# Altium schematic sheet Controller.SchDoc
size A4
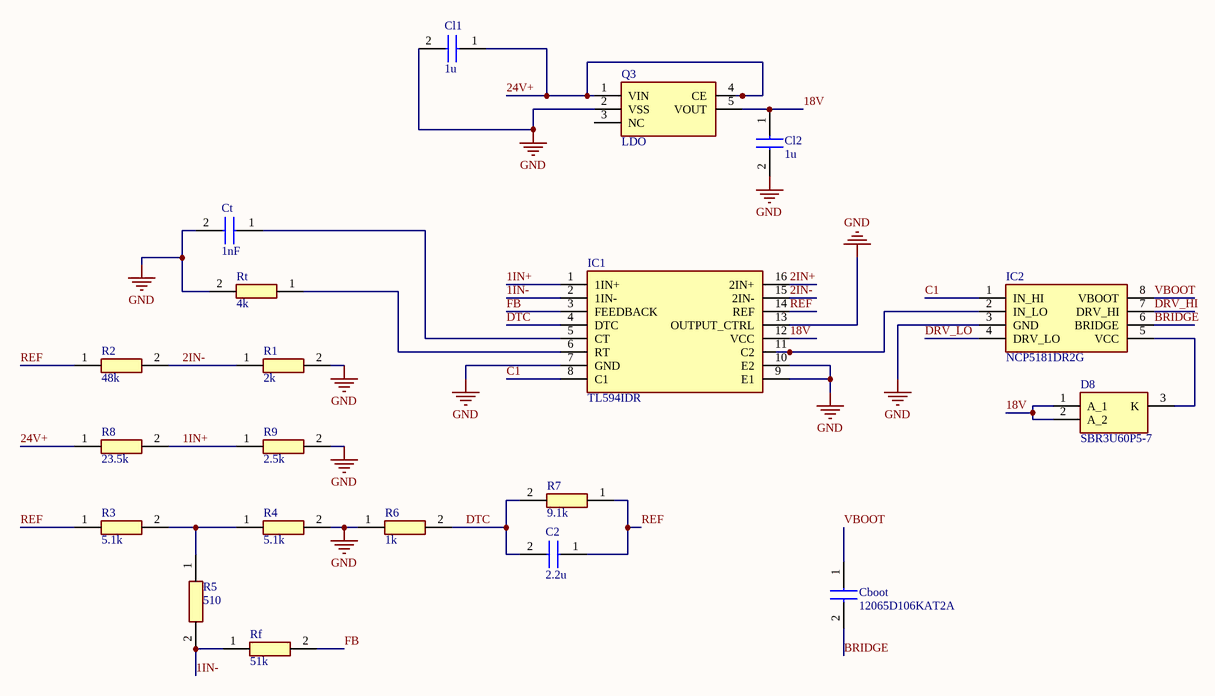
[diagram p0: Controller.SchDoc]

## Parts
C2  2.2u  [CAPC1005X55N]
Cboot  12065D106KAT2A  [CAPC3216X229N]
Cl1  1u  [CAPC3225X105N]
Cl2  1u  [CAPC3225X105N]
Ct  1nF  [CAPC1608X90N]
D8  SBR3U60P5-7  [SBR3U60P57]
IC1  TL594IDR  [SOIC127P600X175-16N]
IC2  NCP5181DR2G  [SOIC127P600X175-8N]
Q3  LDO  [SOT95P280X120-5N]
R1  2k  [RESC1608X55N]
R2  48k  [RESC2012X65N]
R3  5.1k  [RESC1005X40N]
R4  5.1k  [RESC1005X40N]
R5  510  [RESC1608X50N]
R6  1k  [RESC1608X55N]
R7  9.1k  [RESC1005X40N]
R8  23.5k  [RESC1608X55N]
R9  2.5k  [RESC2012X60N]
Rf  51k  [RESC1005X40N]
Rt  4k  [RESC1608X55N]

## Nets
GND: Cl1.2 Cl2.2 Ct.2 IC1.7(GND) IC1.9(E1) IC1.10(E2) IC1.13(OUTPUT_CTRL) IC2.3(GND) Q3.2(VSS) R1.2 R4.2 R6.1 R9.2 Rt.2
1IN+: IC1.1(1IN+) R8.2 R9.1
1IN-: IC1.2(1IN-) R5.2 Rf.1
2IN+: IC1.16(2IN+)
2IN-: IC1.15(2IN-) R1.1 R2.2
18V: Cl2.1 D8.1(A_1) D8.2(A_2) IC1.12(VCC) Q3.5(VOUT)
24V+: Cl1.1 Q3.1(VIN) Q3.4(CE) R8.1
BRIDGE: Cboot.2 IC2.6(BRIDGE)
C1: IC1.8(C1) IC2.1(IN_HI)
DRV_HI: IC2.7(DRV_HI)
DRV_LO: IC2.4(DRV_LO)
DTC: C2.2 IC1.4(DTC) R6.2 R7.2
FB: IC1.3(FEEDBACK) Rf.2
REF: C2.1 IC1.14(REF) R2.1 R3.1 R7.1
VBOOT: Cboot.1 IC2.8(VBOOT)
NetCt_1: Ct.1 IC1.5(CT)
NetD8_3: D8.3(K) IC2.5(VCC)
NetIC1_6: IC1.6(RT) Rt.1
NetIC1_11: IC1.11(C2) IC2.2(IN_LO)
NetR3_2: R3.2 R4.1 R5.1

Not connected (* = marked no-connect by the designer): Q3 3(NC)

## Library data of the parts
C2 = C0402C225K9PACTU: Capacitor; Manufacturer_Name: Kemet; Datasheet Link: https://content.kemet.com/datasheets/KEM_C1002_X7R_SMD.pdf; Height: 0.55mm; Manufacturer_Part_Number: C0402C225K9PACTU; Mouser Part Number: 80-C0402C225K9P; Mouser Price/Stock: https://www.mouser.co.uk/ProductDetail/KEMET/C0402C225K9PACTU/?qs=7hO1d5R1VgvbvfUaNq9%252BYQ%3D%3D; Arrow Part Number: C0402C225K9PACTU; Arrow Price/Stock: https://www.arrow.com/en/products/c0402c225k9pactu/kemet-corporation
Cboot = 12065D106KAT2A: Capacitor; Manufacturer_Name: AVX; Datasheet Link: http://datasheets.avx.com/cx5r.pdf; Height: 2.29mm; Manufacturer_Part_Number: 12065D106KAT2A; Mouser Part Number: 581-12065D106KAT2A; Mouser Price/Stock: https://www.mouser.co.uk/ProductDetail/AVX/12065D106KAT2A?qs=KdTYp8tcPglFZs244%2FIMaw%3D%3D; Arrow Part Number: 12065D106KAT2A; Arrow Price/Stock: https://www.arrow.com/en/products/12065d106kat2a/avx
Cl1 Cl2 = 885012209047: Capacitor; Manufacturer_Name: Wurth Elektronik; Datasheet Link: https://katalog.we-online.com/pbs/datasheet/885012209047.pdf; Height: 1.05mm; Manufacturer_Part_Number: 885012209047; Mouser Part Number: 710-885012209047; Mouser Price/Stock: https://www.mouser.co.uk/ProductDetail/Wurth-Elektronik/885012209047/?qs=0KOYDY2FL29YEbVS2nM5KQ%3D%3D
Ct = 06031C102KAZ2A: Capacitor; Manufacturer_Name: AVX; Datasheet Link: https://componentsearchengine.com/Datasheets/1/06031A100FAT2A.pdf; Height: 0.9mm; Manufacturer_Part_Number: 06031C102KAZ2A; Mouser Part Number: 581-06031C102KAZ2A; Mouser Price/Stock: https://www.mouser.co.uk/ProductDetail/AVX/06031C102KAZ2A?qs=ahudlVbFbatc7%2FoXGMS0PQ%3D%3D
D8 = SBR3U60P5-7: Schottky Diode; Manufacturer_Name: Diodes Inc.; Datasheet Link: https://www.mouser.com/datasheet/2/115/SBR3U60P5-941054.pdf; Height: 1.1mm; Manufacturer_Part_Number: SBR3U60P5-7; Mouser Part Number: 621-SBR3U60P5-7; Mouser Price/Stock: https://www.mouser.co.uk/ProductDetail/Diodes-Incorporated/SBR3U60P5-7/?qs=nJRy1mI8RR%252BxxKqfP%2FhEGg%3D%3D; Arrow Part Number: SBR3U60P5-7; Arrow Price/Stock: https://www.arrow.com/en/products/sbr3u60p5-7/diodes-incorporated
IC1 = TL594IDR: Integrated Circuit; Manufacturer_Name: Texas Instruments; Datasheet Link: http://www.ti.com/lit/gpn/TL594; Height: 1.75mm; Manufacturer_Part_Number: TL594IDR; Mouser Part Number: 595-TL594IDR; Mouser Price/Stock: https://www.mouser.co.uk/ProductDetail/Texas-Instruments/TL594IDR/?qs=odmYgEirbwx2xq08uKs%2FLA%3D%3D; Arrow Part Number: TL594IDR; Arrow Price/Stock: https://www.arrow.com/en/products/tl594idr/texas-instruments
IC2 = NCP5181DR2G: Integrated Circuit; Manufacturer_Name: ON Semiconductor; Datasheet Link: http://www.onsemi.com/pub/Collateral/NCP5181-D.PDF; Height: 1.75mm; Manufacturer_Part_Number: NCP5181DR2G; Mouser Part Number: 863-NCP5181DR2G; Mouser Price/Stock: https://www.mouser.co.uk/ProductDetail/ON-Semiconductor/NCP5181DR2G/?qs=OSf9jACorvZepnMsAKlxsQ%3D%3D; Arrow Part Number: NCP5181DR2G; Arrow Price/Stock: https://www.arrow.com/en/products/ncp5181dr2g/on-semiconductor
Q3 = XC6210B302MR-G: Transistor; Manufacturer_Name: Torex; Datasheet Link: https://componentsearchengine.com/Datasheets/1/XC6210B302MR-G.pdf; Height: 1.2mm; Manufacturer_Part_Number: XC6210B302MR-G; Mouser Part Number: 865-XC6210B302MR-G; Mouser Price/Stock: https://www.mouser.co.uk/ProductDetail/Torex-Semiconductor/XC6210B302MR-G?qs=AsjdqWjXhJ%2F8LVwdgROYaw%3D%3D
R1 R6 = RCA060310R0FKEAHP: Resistor; Manufacturer_Name: Vishay; Datasheet Link: https://www.vishay.com/docs/20067/rcahp.pdf; Height: 0.55mm; Manufacturer_Part_Number: RCA060310R0FKEAHP; Arrow Part Number: RCA060310R0FKEAHP; Arrow Price/Stock: https://www.arrow.com/en/products/rca060310r0fkeahp/vishay
R2 = CPF0805B49K9E1: Resistor; Manufacturer_Name: TE Connectivity; Datasheet Link: http://docs-europe.electrocomponents.com/webdocs/13d1/0900766b813d116f.pdf; Height: 0.65mm; Manufacturer_Part_Number: CPF0805B49K9E1; Mouser Part Number: 279-CPF0805B49K9E1; Mouser Price/Stock: https://www.mouser.co.uk/ProductDetail/TE-Connectivity-Holsworthy/CPF0805B49K9E1/?qs=iJVBkmKXgrkcN8Razl5GKw%3D%3D
R3 R4 = CRCW04025K10JNED: Resistor; Manufacturer_Name: Vishay; Datasheet Link: http://www.vishay.com/docs/20035/dcrcwe3.pdf; Height: 0.4mm; Manufacturer_Part_Number: CRCW04025K10JNED; Mouser Part Number: 71-CRCW0402J-5.1K-E3; Mouser Price/Stock: https://www.mouser.co.uk/ProductDetail/Vishay-Dale/CRCW04025K10JNED/?qs=DKbL89i6OEozZLVEbDGZhw%3D%3D; Arrow Part Number: CRCW04025K10JNED; Arrow Price/Stock: https://www.arrow.com/en/products/crcw04025k10jned/vishay
R5 = CRCW0603510RJNEA: Resistor; Manufacturer_Name: Vishay; Datasheet Link: http://www.vishay.com/docs/20035/dcrcwe3.pdf; Height: 0.5mm; Manufacturer_Part_Number: CRCW0603510RJNEA; Mouser Part Number: 71-CRCW0603J-510-E3; Mouser Price/Stock: https://www.mouser.co.uk/ProductDetail/Vishay-Dale/CRCW0603510RJNEA/?qs=F8Fiu5nZiPjhir5Uy48eTQ%3D%3D; Arrow Part Number: CRCW0603510RJNEA; Arrow Price/Stock: https://www.arrow.com/en/products/crcw0603510rjnea/vishay
R7 = CRCW04029K10JNED: Resistor; Manufacturer_Name: Vishay; Datasheet Link: http://www.vishay.com/docs/20035/dcrcwe3.pdf; Height: 0.4mm; Manufacturer_Part_Number: CRCW04029K10JNED; Mouser Part Number: 71-CRCW0402J-9.1K-E3; Mouser Price/Stock: https://www.mouser.co.uk/ProductDetail/Vishay-Dale/CRCW04029K10JNED/?qs=lxmYmG9KtX%2FHs4nfN6Hr1A%3D%3D
R8 Rt = MCT06030C2352FP500: Resistor; Manufacturer_Name: Vishay; Datasheet Link: http://www.vishay.com/docs/28705/mcx0x0xpro.pdf; Height: 0.55mm; Manufacturer_Part_Number: MCT06030C2352FP500; Mouser Part Number: N/A; Mouser Price/Stock: https://www.mouser.co.uk/ProductDetail/Vishay-Beyschlag/MCT06030C2352FP500/?qs=iuLH8FrUFAt7r3RaJxlO0Q%3D%3D
R9 = RN732ATTD2501B25: Resistor; Manufacturer_Name: KOA Speer; Datasheet Link: https://www.mouser.fr/datasheet/2/219/RN73-11994.pdf; Height: 0.6mm; Manufacturer_Part_Number: RN732ATTD2501B25; Mouser Part Number: 660-RN732ATTD2501B25; Mouser Price/Stock: https://www.mouser.co.uk/ProductDetail/KOA-Speer/RN732ATTD2501B25/?qs=PieNiMrGZlrhcfEc14mnog%3D%3D; Arrow Part Number: RN732ATTD2501B25; Arrow Price/Stock: https://www.arrow.com/en/products/rn732attd2501b25/koa-speer-electronics
Rf = MCMR04X5102FTL: Resistor; Manufacturer_Name: MULTICOMP; Datasheet Link: http://www.farnell.com/datasheets/1716707.pdf; Height: 0.4mm; Manufacturer_Part_Number: MCMR04X5102FTL